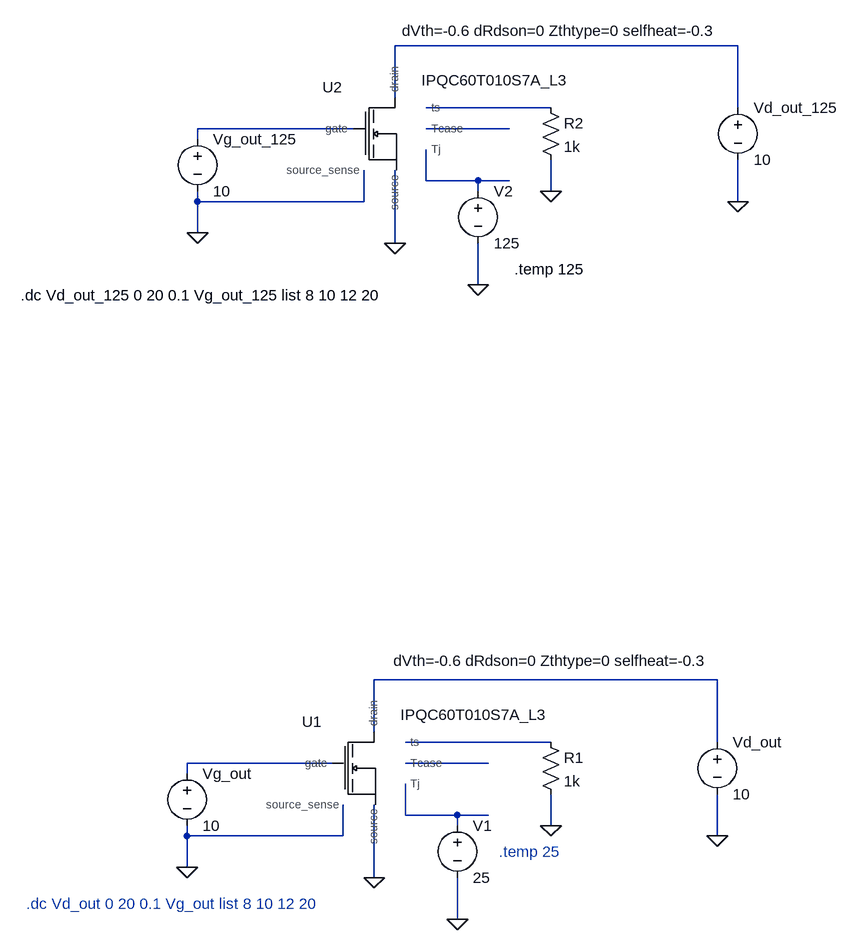
[diagram p0: schematic Si_MOSFET_out.asc]
Si_MOSFET_out.asc, the LTspice schematic file:
Version 4.1
SHEET 1 2716 680
WIRE 768 -944 240 -944
WIRE 240 -864 240 -944
WIRE 480 -848 288 -848
WIRE 768 -848 768 -944
WIRE 176 -816 -64 -816
WIRE 416 -816 288 -816
WIRE -64 -800 -64 -816
WIRE 288 -736 288 -784
WIRE 368 -736 288 -736
WIRE 416 -736 368 -736
WIRE 368 -720 368 -736
WIRE 480 -720 480 -768
WIRE -64 -704 -64 -720
WIRE 192 -704 192 -752
WIRE 192 -704 -64 -704
WIRE 768 -704 768 -768
WIRE -64 -656 -64 -704
WIRE 240 -640 240 -752
WIRE 368 -576 368 -640
WIRE 736 32 208 32
WIRE 208 112 208 32
WIRE 480 128 256 128
WIRE 736 128 736 32
WIRE 144 160 -80 160
WIRE 384 160 256 160
WIRE -80 176 -80 160
WIRE 256 240 256 192
WIRE 336 240 256 240
WIRE 384 240 336 240
WIRE 336 256 336 240
WIRE 480 256 480 208
WIRE -80 272 -80 256
WIRE 160 272 160 224
WIRE 160 272 -80 272
WIRE 736 272 736 208
WIRE -80 320 -80 272
WIRE 208 336 208 224
WIRE 336 400 336 336
FLAG -80 320 0
FLAG 736 272 0
FLAG 208 336 0
FLAG 480 256 0
FLAG 336 400 0
FLAG -64 -656 0
FLAG 768 -704 0
FLAG 240 -640 0
FLAG 480 -720 0
FLAG 368 -576 0
SYMBOL IPQC60T010S7_L3 208 176 R0
WINDOW 39 273 -189 Top 2
SYMATTR SpiceLine dVth=-0.6 dRdson=0 Zthtype=0 selfheat=-0.3
SYMATTR InstName U1
SYMBOL voltage -80 160 R0
WINDOW 123 0 0 Left 0
WINDOW 39 0 0 Left 0
SYMATTR InstName Vg_out
SYMATTR Value 10
SYMBOL voltage 736 112 R0
SYMATTR InstName Vd_out
SYMATTR Value 10
SYMBOL res 464 112 R0
SYMATTR InstName R1
SYMATTR Value 1k
SYMBOL voltage 336 240 R0
WINDOW 123 0 0 Left 0
WINDOW 39 0 0 Left 0
SYMATTR InstName V1
SYMATTR Value 25
SYMBOL IPQC60T010S7_L3 240 -800 R0
WINDOW 39 254 -182 Top 2
SYMATTR SpiceLine dVth=-0.6 dRdson=0 Zthtype=0 selfheat=-0.3
SYMATTR InstName U2
SYMBOL voltage -64 -816 R0
WINDOW 123 0 0 Left 0
WINDOW 39 0 0 Left 0
SYMATTR InstName Vg_out_125
SYMATTR Value 10
SYMBOL voltage 768 -864 R0
SYMATTR InstName Vd_out_125
SYMATTR Value 10
SYMBOL res 464 -864 R0
SYMATTR InstName R2
SYMATTR Value 1k
SYMBOL voltage 368 -736 R0
WINDOW 123 0 0 Left 0
WINDOW 39 0 0 Left 0
SYMATTR InstName V2
SYMATTR Value 125
TEXT -328 376 Left 2 ;.dc Vd_out 0 20 0.1 Vg_out list 8 10 12 20
TEXT 400 296 Left 2 ;.temp 25
TEXT 424 -600 Left 2 !.temp 125
TEXT -336 -560 Left 2 !.dc Vd_out_125 0 20 0.1 Vg_out_125 list 8 10 12 20

The netlist it stands for:
* Si_MOSFET_out.asc
X§U1 N006 N008 0 0 N007 N010 N009 IPQC60T010S7A_L3 dVth=-0.6 dRdson=0 Zthtype=0 selfheat=-0.3  ; pins drain gate source source_sense ts Tj Tcase
Vg_out N008 0 10
Vd_out N006 0 10
R1 N007 0 1k
V1 N010 0 25
X§U2 N001 N003 0 0 N002 N005 N004 IPQC60T010S7A_L3 dVth=-0.6 dRdson=0 Zthtype=0 selfheat=-0.3  ; pins drain gate source source_sense ts Tj Tcase
Vg_out_125 N003 0 10
Vd_out_125 N001 0 10
R2 N002 0 1k
V2 N005 0 125
* .dc Vd_out 0 20 0.1 Vg_out list 8 10 12 20
* .temp 25
.temp 125
.dc Vd_out_125 0 20 0.1 Vg_out_125 list 8 10 12 20
.lib IFX_S7A_TS_600V.lib
.backanno
.end